# EAGLE schematic BatteryCharger (EAGLE 9.7.0)
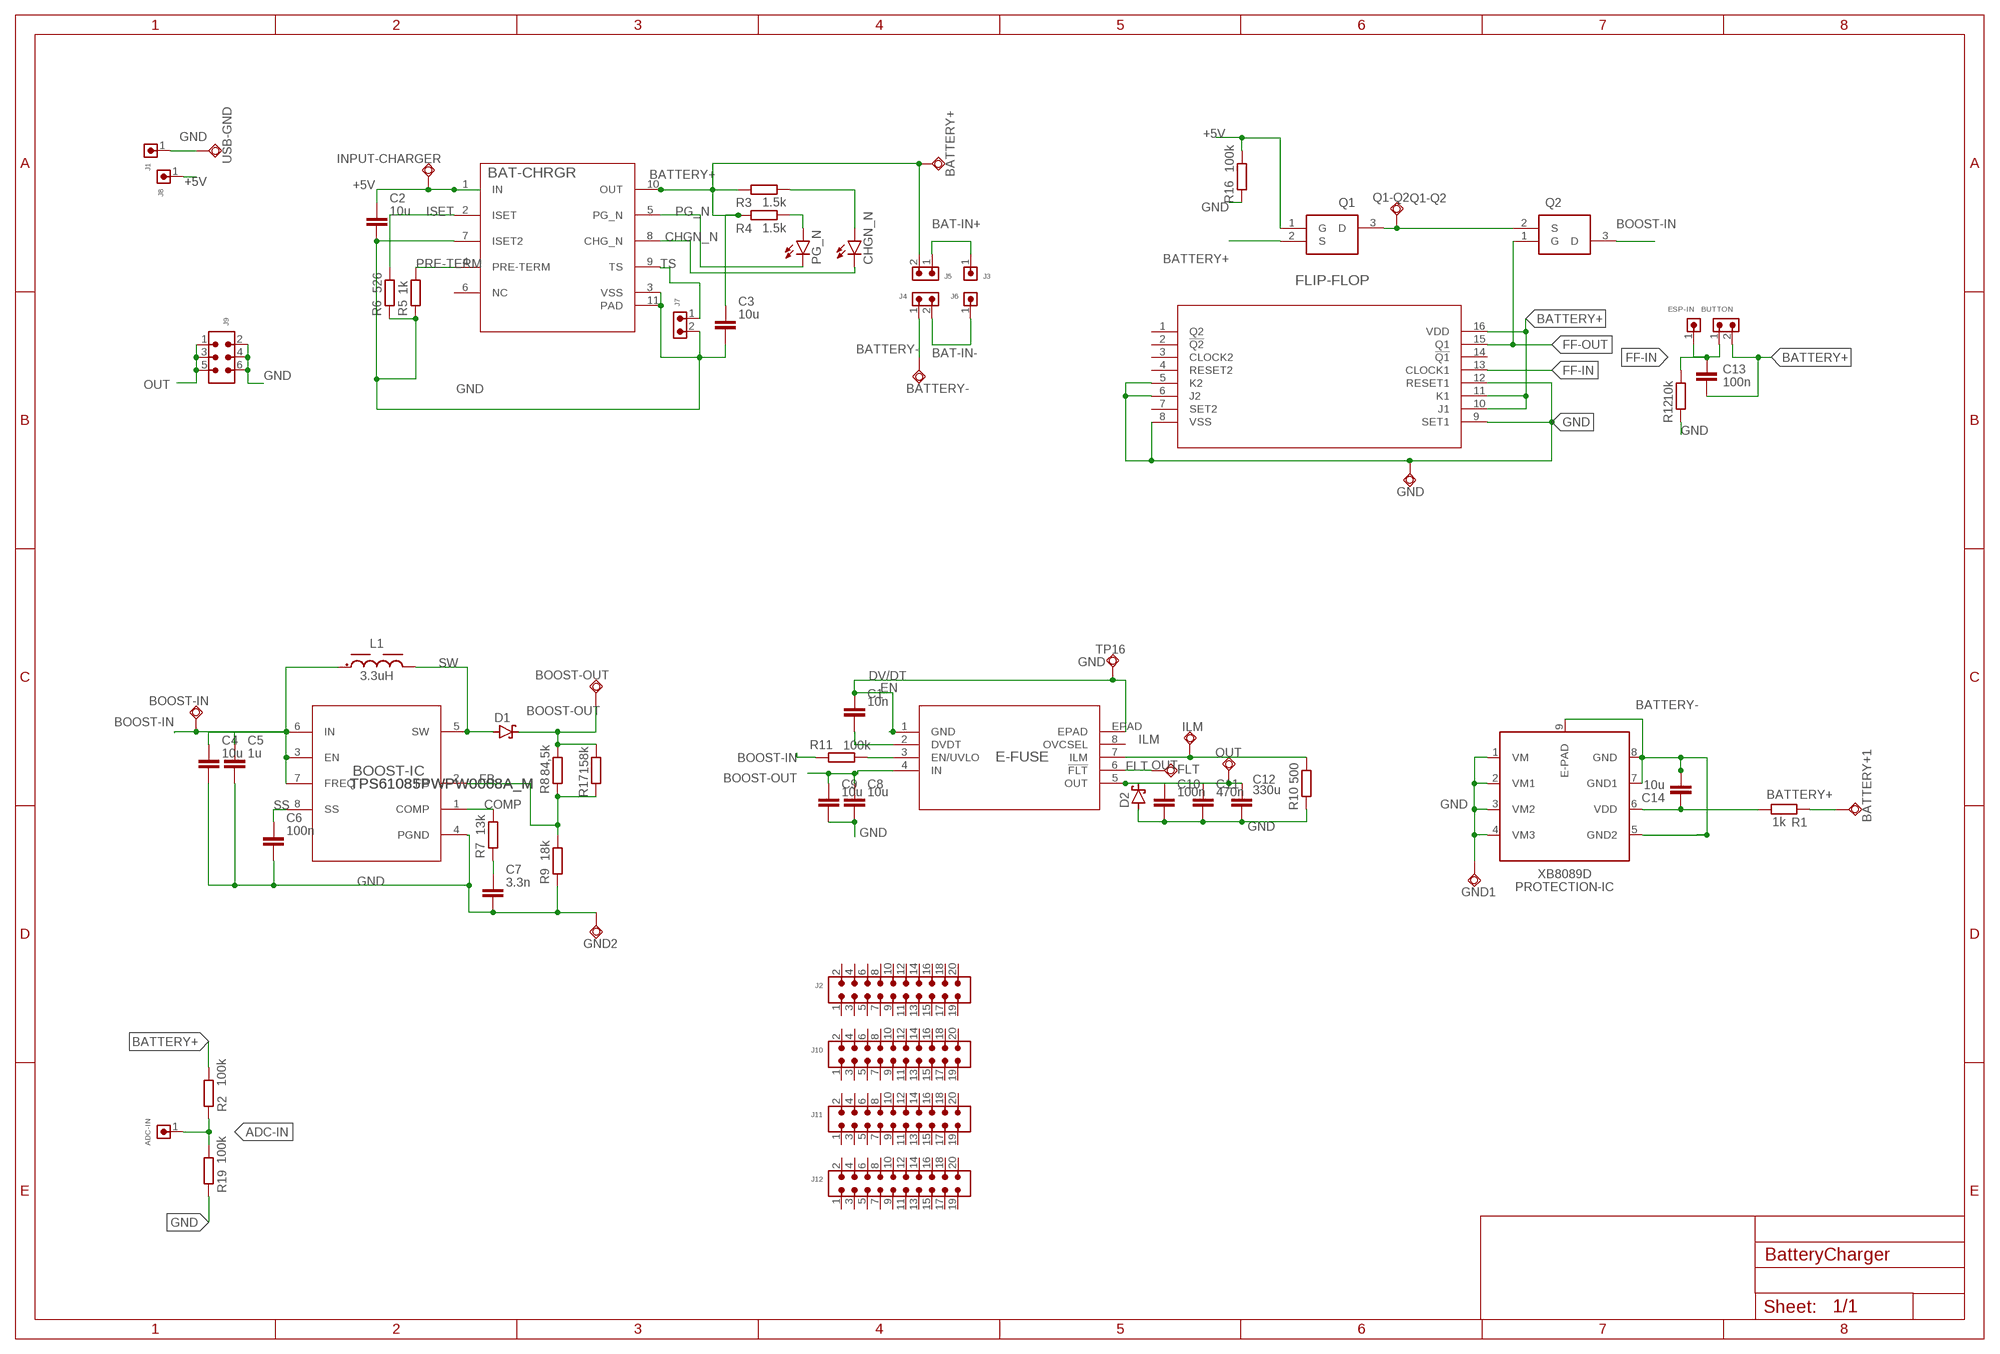
[diagram p0: schematic, sheet 1]

## Parts
ADC-IN  6130XX11121_61300111121  [61300111121]
BAT-CHRGR  BQ24092DGQRDGQ0010D_NV_L  [DGQ0010D_NV_L]
BATTERY+  TPSQPAD1-13  [P1-13]
BATTERY+1  TPSQPAD1-13  [P1-13]
BATTERY-  TPSQPAD1-13  [P1-13]
BOOST-IC  TPS61085PWPW0008A_M  [PW0008A_M]
BOOST-IN  TPSQPAD1-13  [P1-13]
BOOST-OUT  TPSQPAD1-13  [P1-13]
BUTTON  6130XX11121_61300211121  [61300211121]
C1  10n  C_CHIP-1206(3216-METRIC)  [CAPC3216X135]
C2  10u  C_CHIP-1206(3216-METRIC)  [CAPC3216X135]
C3  10u  C_CHIP-1206(3216-METRIC)  [CAPC3216X135]
C4  10u  C_CHIP-1206(3216-METRIC)  [CAPC3216X135]
C5  1u  C_CHIP-1206(3216-METRIC)  [CAPC3216X135]
C6  100n  C_CHIP-1206(3216-METRIC)  [CAPC3216X135]
C7  3.3n  C_CHIP-1206(3216-METRIC)  [CAPC3216X135]
C8  10u  C_CHIP-1206(3216-METRIC)  [CAPC3216X135]
C9  10u  C_CHIP-1206(3216-METRIC)  [CAPC3216X135]
C10  100n  C_CHIP-1206(3216-METRIC)  [CAPC3216X135]
C11  470n  C_CHIP-1206(3216-METRIC)  [CAPC3216X135]
C12  330u  C_RADIAL-12.5MM-DIA  [CAPRD550W60D1025H1250B]
C13  100n  C_CHIP-1206(3216-METRIC)  [CAPC3216X135]
C14  10u  C_CHIP-1206(3216-METRIC)  [CAPC3216X135]
CHGN_N  LEDCHIPLED_1206  [CHIPLED_1206]
D1  SCHOTTKY-DIODESMD  [SMB]
D2  SCHOTTKY-DIODESMD  [SMB]
E-FUSE  TPS259620DDARSOIC_20DDAR_TEX-M  [SOIC_20DDAR_TEX-M]
ESP-IN  6130XX11121_61300111121  [61300111121]
FLIP-FLOP  CD4027BNSRNS16  [NS16]
FLT  TPSQPAD1-13  [P1-13]
GND  TPSQPAD1-13  [P1-13]
GND1  TPSQPAD1-13  [P1-13]
GND2  TPSQPAD1-13  [P1-13]
ILM  TPSQPAD1-13  [P1-13]
INPUT-CHARGER  TPSQPAD1-13  [P1-13]
J1  6130XX11121_61300111121  [61300111121]
J2  6130XX21121_61302021121  [61302021121]
J3  6130XX11121_61300111121  [61300111121]
J4  6130XX11121_61300211121  [61300211121]
J5  6130XX11121_61300211121  [61300211121]
J6  6130XX11121_61300111121  [61300111121]
J7  6130XX11121_61300211121  [61300211121]
J8  6130XX11121_61300111121  [61300111121]
J9  6130XX21121_61300621121  [61300621121]
J10  6130XX21121_61302021121  [61302021121]
J11  6130XX21121_61302021121  [61302021121]
J12  6130XX21121_61302021121  [61302021121]
L1  3.3uH  WE-PD_7345_744777001  [WE-PD_7345]
OUT  TPSQPAD1-13  [P1-13]
PG_N  LEDCHIPLED_1206  [CHIPLED_1206]
PROTECTION-IC  XB8089D  [XB8089D]
Q1  DMP3098L-7  [SOT96P240X110-3N]
Q1-Q2  TPSQPAD1-13  [P1-13]
Q2  DMP3098L-7  [SOT96P240X110-3N]
R1  1k  R_CHIP-1206(3216-METRIC)  [RESC3216X70]
R2  100k  R_CHIP-1206(3216-METRIC)  [RESC3216X70]
R3  1.5k  R_CHIP-1206(3216-METRIC)  [RESC3216X70]
R4  1.5k  R_CHIP-1206(3216-METRIC)  [RESC3216X70]
R5  1k  R_CHIP-1206(3216-METRIC)  [RESC3216X70]
R6  526  R_CHIP-1206(3216-METRIC)  [RESC3216X70]
R7  13k  R_CHIP-1206(3216-METRIC)  [RESC3216X70]
R8  84,5k  R_CHIP-1206(3216-METRIC)  [RESC3216X70]
R9  18k  R_CHIP-1206(3216-METRIC)  [RESC3216X70]
R10  500  R_CHIP-1206(3216-METRIC)  [RESC3216X70]
R11  100k  R_CHIP-1206(3216-METRIC)  [RESC3216X70]
R12  10k  R_CHIP-1206(3216-METRIC)  [RESC3216X70]
R16  100k  R_CHIP-1206(3216-METRIC)  [RESC3216X70]
R17  158k  R_CHIP-1206(3216-METRIC)  [RESC3216X70]
R19  100k  R_CHIP-1206(3216-METRIC)  [RESC3216X70]
TP16  TPSQPAD1-13  [P1-13]
USB-GND  TPSQPAD1-13  [P1-13]

## Nets
+5V: BAT-CHRGR.1(IN) C2.1 INPUT-CHARGER.TP J8.1 Q1.1(G) R16.2
ADC-IN: ADC-IN.1 R2.2 R19.1
BAT-IN+: J3.1 J5.1
BAT-IN-: J4.2 J6.1
BATTERY+: BAT-CHRGR.10(OUT) BATTERY+1.TP BATTERY+.TP BUTTON.2 C3.1 C13.2 FLIP-FLOP.10(J1) FLIP-FLOP.11(K1) FLIP-FLOP.16(VDD) J5.2 Q1.2(S) R1.1 R2.1 R3.2 R4.2
BATTERY-: BATTERY-.TP C14.2 J4.1 PROTECTION-IC.5(GND2) PROTECTION-IC.7(GND1) PROTECTION-IC.8(GND) PROTECTION-IC.9(E-PAD)
BOOST-IN: BOOST-IC.3(EN) BOOST-IC.6(IN) BOOST-IC.7(FREQ) BOOST-IN.TP C4.1 C5.1 L1.1 Q2.3(D) R11.1
BOOST-OUT: BOOST-OUT.TP C8.1 C9.1 D1.C E-FUSE.4(IN) R8.2 R17.2
CHGN_N: BAT-CHRGR.8(CHG_N) CHGN_N.C
COMP: BOOST-IC.1(COMP) R7.2
DV/DT: C1.2 E-FUSE.2(DVDT)
EN: E-FUSE.3(EN/UVLO) R11.2
FB: BOOST-IC.2(FB) R8.1 R9.2 R17.1
FF-IN: BUTTON.1 C13.1 ESP-IN.1 FLIP-FLOP.13(CLOCK1) R12.2
FF-OUT: FLIP-FLOP.15(Q1) Q2.1(G)
FLT: E-FUSE.6(!FLT) FLT.TP
GND: BAT-CHRGR.3(VSS) BAT-CHRGR.7(ISET2) BAT-CHRGR.11(PAD) BOOST-IC.4(PGND) C1.1 C2.2 C3.2 C4.2 C5.2 C6.2 C7.2 C8.2 C9.2 C10.2 C11.2 C12.2 D2.A E-FUSE.1(GND) E-FUSE.EPAD FLIP-FLOP.5(K2) FLIP-FLOP.6(J2) FLIP-FLOP.8(VSS) FLIP-FLOP.9(SET1) FLIP-FLOP.12(RESET1) GND1.TP GND2.TP GND.TP J1.1 J7.2 J9.2 J9.4 J9.6 PROTECTION-IC.1(VM) PROTECTION-IC.2(VM1) PROTECTION-IC.3(VM2) PROTECTION-IC.4(VM3) R5.1 R6.1 R9.1 R10.1 R12.1 R16.1 R19.2 TP16.TP USB-GND.TP
ILM: E-FUSE.7(ILM) ILM.TP R10.2
ISET: BAT-CHRGR.2(ISET) R6.2
N$3: C14.1 PROTECTION-IC.6(VDD) R1.2
N$9: CHGN_N.A R3.1
N$10: PG_N.A R4.1
N$19: C7.1 R7.1
OUT: C10.1 C11.1 C12.1 D2.C E-FUSE.5(OUT) J9.1 J9.3 J9.5 OUT.TP
PG_N: BAT-CHRGR.5(PG_N) PG_N.C
PRE-TERM: BAT-CHRGR.4(PRE-TERM) R5.2
Q1-Q2: Q1-Q2.TP Q1.3(D) Q2.2(S)
SS: BOOST-IC.8(SS) C6.1
SW: BOOST-IC.5(SW) D1.A L1.2
TS: BAT-CHRGR.9(TS) J7.1
Unconnected: BAT-CHRGR.6(NC) E-FUSE.8(OVCSEL) FLIP-FLOP.1(Q2) FLIP-FLOP.2(!Q2) FLIP-FLOP.3(CLOCK2) FLIP-FLOP.4(RESET2) FLIP-FLOP.7(SET2) FLIP-FLOP.14(!Q1) J2.1 J2.2 J2.3 J2.4 J2.5 J2.6 J2.7 J2.8 J2.9 J2.10 J2.11 J2.12 J2.13 J2.14 J2.15 J2.16 J2.17 J2.18 J2.19 J2.20 J10.1 J10.2 J10.3 J10.4 J10.5 J10.6 J10.7 J10.8 J10.9 J10.10 J10.11 J10.12 J10.13 J10.14 J10.15 J10.16 J10.17 J10.18 J10.19 J10.20 J11.1 J11.2 J11.3 J11.4 J11.5 J11.6 J11.7 J11.8 J11.9 J11.10 J11.11 J11.12 J11.13 J11.14 J11.15 J11.16 J11.17 J11.18 J11.19 J11.20 J12.1 J12.2 J12.3 J12.4 J12.5 J12.6 J12.7 J12.8 J12.9 J12.10 J12.11 J12.12 J12.13 J12.14 J12.15 J12.16 J12.17 J12.18 J12.19 J12.20

## Library data of the parts
ADC-IN ESP-IN J1 J3 J6 J8 = 61001021121_Eagle_WR-PHD_rev19a:6130XX11121_61300111121: WR-PHD 2.54 mm THT Pin Header ARTICLE PROPERTIES: Pins:1;​ 2;​ 3;​ 4;​ 5;​ 6;​ 7;​ 8;​ 9;​ 10;​ 12;​ 13;​ 14;​ 15;​ 16;​ 18;​ 20;​ 22;​ 24;​ 25;​ 32;​ 36;​ 40 KIND PROPERTIES: Pitch：2.54 mm Quality Class:3 as per CECC 75 301-802 Rows：Single Gender：Pin Header Type：Straight MATERIAL PROPERTIES: Insulator Material :PBT Insulator Flammability Rating:UL94 V-0 Contact Material:Copper Alloy Contact Plating:Gold Contact Type:Stamped GENERAL INFORMATION Operating Temperature:-40 up to +105 °C Compliance:RoHS ELECTRICAL PROPERTIES: Rated Current:3 A IR 1:3 A Withstanding Voltage:500 V (AC) Contact Resistance:20 mΩ RISO:1000 MΩ CERTIFICATION UL Approval:E323964 PACKAGING PROPERTIES Packaging:Bag <https://katalog.we-online.com/media/images/v2/o33211v209%20Family_BTB_PHD_6130xx11121.jpg> Details see: https://katalog.we-online.com/en/em/PHD_2_54_THT_PIN_HEADER_6130XX11121 Updated by Yingchun,Shan 2019-10-16 2019 (C) Würth Elektronik; DATASHEET-URL: https://katalog.we-online.com/em/datasheet/61300111121.pdf; GENDER: Pin Header; IR: 3A; MATES: WR-PHD 2.54mm Angled Socket Header /SMT Socket Header/Socket Header; PACKAGING: Bag; PART-NUMBER: 61300111121; PINS: 1; ROWS: Single; TYPE: Straight
BAT-CHRGR = BQ24092DGQR:BQ24092DGQR; COPYRIGHT: Copyright (C) 2023 Ultra Librarian. All rights reserved.; MANUFACTURER_PART_NUMBER: BQ24092DGQR; MFR_NAME: Texas Instruments; REFDES: RefDes; TYPE: TYPE
BATTERY+ BATTERY+1 BATTERY- BOOST-IN BOOST-OUT FLT GND GND1 GND2 ILM INPUT-CHARGER OUT Q1-Q2 TP16 USB-GND = testpad:TPSQ: Test pad
BOOST-IC = Bibliothek:TPS61085PW; COPYRIGHT: Copyright (C) 2023 Ultra Librarian. All rights reserved.; MANUFACTURER_PART_NUMBER: TPS61085PW; MFR_NAME: Texas Instruments; REFDES: RefDes; TYPE: TYPE
BUTTON J4 J5 J7 = 61001021121_Eagle_WR-PHD_rev19a:6130XX11121_61300211121: WR-PHD 2.54 mm THT Pin Header ARTICLE PROPERTIES: Pins:1;​ 2;​ 3;​ 4;​ 5;​ 6;​ 7;​ 8;​ 9;​ 10;​ 12;​ 13;​ 14;​ 15;​ 16;​ 18;​ 20;​ 22;​ 24;​ 25;​ 32;​ 36;​ 40 KIND PROPERTIES: Pitch：2.54 mm Quality Class:3 as per CECC 75 301-802 Rows：Single Gender：Pin Header Type：Straight MATERIAL PROPERTIES: Insulator Material :PBT Insulator Flammability Rating:UL94 V-0 Contact Material:Copper Alloy Contact Plating:Gold Contact Type:Stamped GENERAL INFORMATION Operating Temperature:-40 up to +105 °C Compliance:RoHS ELECTRICAL PROPERTIES: Rated Current:3 A IR 1:3 A Withstanding Voltage:500 V (AC) Contact Resistance:20 mΩ RISO:1000 MΩ CERTIFICATION UL Approval:E323964 PACKAGING PROPERTIES Packaging:Bag <https://katalog.we-online.com/media/images/v2/o33211v209%20Family_BTB_PHD_6130xx11121.jpg> Details see: https://katalog.we-online.com/en/em/PHD_2_54_THT_PIN_HEADER_6130XX11121 Updated by Yingchun,Shan 2019-10-16 2019 (C) Würth Elektronik; DATASHEET-URL: https://katalog.we-online.com/em/datasheet/61300211121.pdf; GENDER: Pin Header; IR: 3A; MATES: WR-PHD 2.54mm Angled Socket Header /SMT Socket Header/Socket Header; PACKAGING: Bag; PART-NUMBER: 61300211121; PINS: 2; ROWS: Single; TYPE: Straight
C1-C14 = Capacitor:C: Capacitor - Generic; CATEGORY: Capacitor
CHGN_N PG_N = LED:LED: LED OSRAM: - CHIPLED LG R971, LG N971, LY N971, LG Q971, LY Q971, LO R971, LY R971 LH N974, LH R974 LS Q976, LO Q976, LY Q976 LO Q996 - Hyper CHIPLED LW Q18S LB Q993, LB Q99A, LB R99A - SideLED LS A670, LO A670, LY A670, LG A670, LP A670 LB A673, LV A673, LT A673, LW A673 LH A674 LY A675 LS A676, LA A676, LO A676, LY A676, LW A676 LS A679, LY A679, LG A679 - Hyper Micro SIDELED® LS Y876, LA Y876, LO Y876, LY Y876 LT Y87S - SmartLED LW L88C, LW L88S LB L89C, LB L89S, LG L890 LS L89K, LO L89K, LY L89K LS L896, LA L896, LO L896, LY L896 - TOPLED LS T670, LO T670, LY T670, LG T670, LP T670 LSG T670, LSP T670, LSY T670, LOP T670, LYG T670 LG T671, LOG T671, LSG T671 LB T673, LV T673, LT T673, LW T673 LH T674 LS T676, LA T676, LO T676, LY T676, LB T676, LH T676, LSB T676, LW T676 LB T67C, LV T67C, LT T67C, LS T67K, LO T67K, LY T67K, LW E67C LS E67B, LA E67B, LO E67B, LY E67B, LB E67C, LV E67C, LT E67C LW T67C LS T679, LY T679, LG T679 LS T770, LO T770, LY T770, LG T770, LP T770 LB T773, LV T773, LT T773, LW T773 LH T774 LS E675, LA E675, LY E675, LS T675 LS T776, LA T776, LO T776, LY T776, LB T776 LHGB T686 LT T68C, LB T68C - Hyper Mini TOPLED® LB M676 - Mini TOPLED Santana® LG M470 LS M47K, LO M47K, LY M47K Source: http://www.osram.convergy.de LUXEON: - LUMILED® LXK2-PW12-R00, LXK2-PW12-S00, LXK2-PW14-U00, LXK2-PW14-V00 LXK2-PM12-R00, LXK2-PM12-S00, LXK2-PM14-U00 LXK2-PE12-Q00, LXK2-PE12-R00, LXK2-PE12-S00, LXK2-PE14-T00, LXK2-PE14-U00 LXK2-PB12-K00, LXK2-PB12-L00, LXK2-PB12-M00, LXK2-PB14-N00, LXK2-PB14-P00, LXK2-PB14-Q00 LXK2-PR12-L00, LXK2-PR12-M00, LXK2-PR14-Q00, LXK2-PR14-R00 LXK2-PD12-Q00, LXK2-PD12-R00, LXK2-PD12-S00 LXK2-PH12-R00, LXK2-PH12-S00 LXK2-PL12-P00, LXK2-PL12-Q00, LXK2-PL12-R00 Source: www.luxeon.com KINGBRIGHT: KA-3528ASYC Source: www.kingbright.com
D1 D2 = Diode:SCHOTTKY-DIODE: Schottky Diode
E-FUSE = TPS259620DDAR:TPS259620DDAR; COPYRIGHT: Copyright (C) 2023 Ultra Librarian. All rights reserved.; MANUFACTURER_PART_NUMBER: TPS259620DDAR; MFR_NAME: Texas Instruments
FLIP-FLOP = CD4027B:CD4027BNSR; COPYRIGHT: Copyright (C) 2023 Ultra Librarian. All rights reserved.; MANUFACTURER_PART_NUMBER: CD4027BNSR; MFR_NAME: Texas Instruments
J2 J10-J12 = 61001021121_Eagle_WR-PHD_rev19a:6130XX21121_61302021121: WR-PHD 2.54 mm THT Dual Pin Header ARTICLE PROPERTIES: Pins:4;​ 6;​ 8;​ 10;​ 12;​ 14;​ 16;​ 18;​ 20;​ 22;​ 24;​ 26;​ 28;​ 30;​ 32;​ 34;​ 36;​ 40;​ 44;​ 64;​ 72;​ 80 KIND PROPERTIES: Pitch：2.54 mm Quality Class:3 as per CECC 75 301-802 Rows：Dual Gender：Pin Header Type：Board Stacker MATERIAL PROPERTIES: Insulator Material :PA6T Insulator Flammability Rating:UL94 V-0 Contact Material:Copper Alloy Contact Plating:Gold Contact Type:Stamped GENERAL INFORMATION Operating Temperature:-40 up to +105 °C Compliance:Lead free / RoHS ELECTRICAL PROPERTIES: Rated Current:3 A IR 1:3 A Withstanding Voltage:500 V (AC) Contact Resistance:20 mΩ RISO:1000 MΩ CERTIFICATION UL Approval:E323964 PACKAGING PROPERTIES Packaging:Bag <https://katalog.we-online.com/media/images/v2/o33215v209%20Family_WR-PHD_6130xx21121.jpg> Details see: https://katalog.we-online.com/en/em/PHD_2_54_THT_DUAL_PIN_HEADER_6130XX21121 Updated by Yingchun,Shan 2019-10-16 2019 (C) Würth Elektronik; DATASHEET-URL: https://katalog.we-online.com/em/datasheet/61302021121.pdf; GENDER: Pin Header; IR: 3A; MATES: WR-PHD 2.54mm Angled DualSocket Header/Dual Socket Header/Dual Socket Header Bottom Entry/Dual Socket Header Bottom Entry Large/SMT Dual Socket Header/SMT Dual Socket Header Bottom Entry; PACKAGING: Bag; PART-NUMBER: 61302021121; PINS: 20; ROWS: Dual; TYPE: Board Stacker
J9 = 61001021121_Eagle_WR-PHD_rev19a:6130XX21121_61300621121: WR-PHD 2.54 mm THT Dual Pin Header ARTICLE PROPERTIES: Pins:4;​ 6;​ 8;​ 10;​ 12;​ 14;​ 16;​ 18;​ 20;​ 22;​ 24;​ 26;​ 28;​ 30;​ 32;​ 34;​ 36;​ 40;​ 44;​ 64;​ 72;​ 80 KIND PROPERTIES: Pitch：2.54 mm Quality Class:3 as per CECC 75 301-802 Rows：Dual Gender：Pin Header Type：Board Stacker MATERIAL PROPERTIES: Insulator Material :PA6T Insulator Flammability Rating:UL94 V-0 Contact Material:Copper Alloy Contact Plating:Gold Contact Type:Stamped GENERAL INFORMATION Operating Temperature:-40 up to +105 °C Compliance:Lead free / RoHS ELECTRICAL PROPERTIES: Rated Current:3 A IR 1:3 A Withstanding Voltage:500 V (AC) Contact Resistance:20 mΩ RISO:1000 MΩ CERTIFICATION UL Approval:E323964 PACKAGING PROPERTIES Packaging:Bag <https://katalog.we-online.com/media/images/v2/o33215v209%20Family_WR-PHD_6130xx21121.jpg> Details see: https://katalog.we-online.com/en/em/PHD_2_54_THT_DUAL_PIN_HEADER_6130XX21121 Updated by Yingchun,Shan 2019-10-16 2019 (C) Würth Elektronik; DATASHEET-URL: https://katalog.we-online.com/em/datasheet/61300621121.pdf; GENDER: Pin Header; IR: 3A; MATES: WR-PHD 2.54mm Angled DualSocket Header/Dual Socket Header/Dual Socket Header Bottom Entry/Dual Socket Header Bottom Entry Large/SMT Dual Socket Header/SMT Dual Socket Header Bottom Entry; PACKAGING: Bag; PART-NUMBER: 61300621121; PINS: 6; ROWS: Dual; TYPE: Board Stacker
L1 = Eagle_WE-PD:WE-PD_7345: WE-PD SMT Power Inductor Characteristics AECQ 200 Qualified Ultra low RDC and RAC Highest possible saturation current based on Ferrite Suitable for switching frequency up to 10MHz Temperature dependent parameter available on Redexpert Operating Temperature from -40°C to +125°C / +150°C Types WE-PD: Since always with low loss material, tight tolerances and high saturation behavior compared to other manufacturers in the market WE-PD Robust: Plastic base improves the mechanical stability and efficiency WE-PD Performance: MnZn core improves Saturation and RDC for highest efficiency Applications Switch Mode Power supplies from 0,1W up to 300W Integrated DC DC Converter Ideal for Switch Mode Power supplies with extreme high efficiency (>95%) <https://www.we-online.com/components/media/o194227v209%20Family_WE-PD.jpg> Details see: www.we-online.com/en/components/products/WE-PD Updated by Ella Wu 2023-02-17 2023 (C) Wurth Elektronik; DATASHEET-URL: https://www.we-online.com/redexpert/spec/744777001?ae; FRES: 100MHz; IR: 6.84A; ISAT: 10.2A; MOUNT: SMT; PART-NUMBER: 744777001; RDC-MAX: 10mohm; RDC-TYP: 8.4mohm; SIZE: 7345; VALUE: 1uH; VERSION: Standard
PROTECTION-IC = XB8089D:XB8089D
Q1 Q2 = DMP3098L:DMP3098L-7: P-CHANNEL ENHANCEMENT MODE MOSFET Source: Datasheet <http://componentsearchengine.com/Datasheets/1/DMP3098L-7.pdf>; DESCRIPTION: P-CHANNEL ENHANCEMENT MODE MOSFET; HEIGHT: 1.1mm; MANUFACTURER_NAME: Diodes Incorporated; MANUFACTURER_PART_NUMBER: DMP3098L-7; MOUSER_PART_NUMBER: 621-DMP3098L-7; MOUSER_PRICE-STOCK: https://www.mouser.co.uk/ProductDetail/Diodes-Incorporated/DMP3098L-7?qs=ptj1V1atRAptfFGa76gfNw%3D%3D
R1-R12 R16 R17 R19 = Resistor:R: Resistor Fixed - Generic; CATEGORY: Resistor; SUB-CATEGORY: Fixed